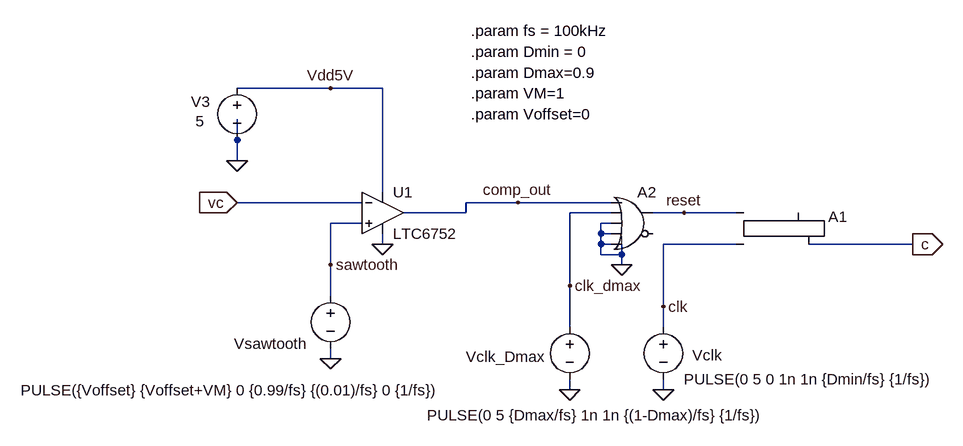
[diagram p0: schematic PWM_schematic.asc]
PWM_schematic.asc, the LTspice schematic file:
Version 4
SHEET 1 1176 680
WIRE -176 -16 -320 -16
WIRE -96 -16 -176 -16
WIRE -320 64 -320 32
WIRE -320 96 -320 64
WIRE -96 144 -96 -16
WIRE -128 160 -320 160
WIRE 112 160 32 160
WIRE 256 160 112 160
WIRE 32 176 32 160
WIRE 32 176 -64 176
WIRE 256 176 192 176
WIRE 368 176 320 176
WIRE 448 176 368 176
WIRE -128 192 -176 192
WIRE 256 192 240 192
WIRE 240 208 240 192
WIRE 256 208 240 208
WIRE -96 224 -96 208
WIRE 240 224 240 208
WIRE 256 224 240 224
WIRE 448 224 336 224
WIRE 720 224 560 224
WIRE 240 240 240 224
WIRE 272 240 272 224
WIRE 272 240 240 240
WIRE -176 256 -176 192
WIRE 272 256 272 240
WIRE 192 288 192 176
WIRE -176 304 -176 256
WIRE 336 320 336 224
WIRE 192 352 192 288
WIRE 336 352 336 320
WIRE -176 400 -176 384
WIRE 192 448 192 432
WIRE 336 448 336 432
FLAG 336 448 0
FLAG -96 224 0
FLAG -176 400 0
FLAG -320 96 0
FLAG 336 320 clk
FLAG -176 256 sawtooth
FLAG 192 448 0
FLAG 192 288 clk_dmax
FLAG 272 256 0
FLAG 368 176 reset
FLAG 720 224 c
IOPIN 720 224 Out
FLAG -320 160 vc
IOPIN -320 160 In
FLAG -176 -16 Vdd5V
FLAG 112 160 comp_out
SYMBOL Digital\\srflop 496 128 R0
WINDOW 3 0 0 Invisible 2
SYMATTR Value Vhigh=5
SYMATTR InstName A1
SYMBOL Comparators\\LTC6752 -96 112 R0
SYMATTR InstName U1
SYMBOL voltage 336 336 R0
WINDOW 0 45 59 Left 2
WINDOW 3 32 96 Left 2
WINDOW 123 0 0 Left 2
WINDOW 39 0 0 Left 2
SYMATTR InstName Vclk
SYMATTR Value PULSE(0 5 0 1n 1n {Dmin/fs} {1/fs})
SYMBOL voltage -176 288 R0
WINDOW 0 -149 89 Left 2
WINDOW 3 -477 161 Left 2
WINDOW 123 0 0 Left 2
WINDOW 39 0 0 Left 2
SYMATTR InstName Vsawtooth
SYMATTR Value PULSE({Voffset} {Voffset+VM} 0 {0.99/fs} {(0.01)/fs} 0 {1/fs})
SYMBOL voltage -320 -32 R0
WINDOW 0 -71 37 Left 2
WINDOW 3 -64 67 Left 2
WINDOW 123 0 0 Left 2
WINDOW 39 0 0 Left 2
SYMATTR InstName V3
SYMATTR Value 5
SYMBOL Digital\\or 288 128 R0
SYMATTR InstName A2
SYMATTR Value2 Vhigh=5
SYMBOL voltage 192 336 R0
WINDOW 0 -160 61 Left 2
WINDOW 3 -220 151 Left 2
WINDOW 123 0 0 Left 2
WINDOW 39 0 0 Left 2
SYMATTR InstName Vclk_Dmax
SYMATTR Value PULSE(0 5 {Dmax/fs} 1n 1n {(1-Dmax)/fs} {1/fs})
TEXT 40 -72 Left 2 !.param Dmin = 0
TEXT 40 -40 Left 2 !.param Dmax=0.9
TEXT 40 -104 Left 2 !.param fs = 100kHz
TEXT 40 -8 Left 2 !.param VM=1
TEXT 40 24 Left 2 !.param Voffset=0

The netlist it stands for:
* PWM_schematic.asc
A1 reset clk 0 0 0 c 0 0 SRFLOP Vhigh=5
XU1 sawtooth vc Vdd5V 0 comp_out LTC6752  ; pins In+ In- V+ V- OUT
Vclk clk 0 PULSE(0 5 0 1n 1n {Dmin/fs} {1/fs})
Vsawtooth sawtooth 0 PULSE({Voffset} {Voffset+VM} 0 {0.99/fs} {(0.01)/fs} 0 {1/fs})
V3 Vdd5V 0 5
A2 comp_out clk_dmax 0 0 0 0 reset 0 OR Vhigh=5
Vclk_Dmax clk_dmax 0 PULSE(0 5 {Dmax/fs} 1n 1n {(1-Dmax)/fs} {1/fs})
.param Dmin = 0
.param Dmax=0.9
.param fs = 100kHz
.param VM=1
.param Voffset=0
.lib LTC7.lib
.backanno
.end